# Altium schematic sheet rail_safety.SchDoc
size A
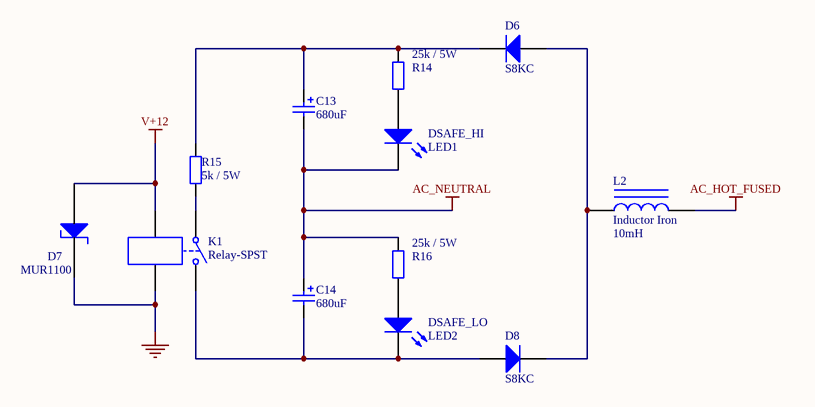
[diagram p0: rail_safety.SchDoc]

## Parts
C13  value 680uF  [Cap_450v_680uF]  (hidden comment: Cap Pol3)
C14  value 680uF  [Cap_450v_680uF]  (hidden comment: Cap Pol3)
D6  S8KC
D7  MUR1100  [DIODE-0.4]
D8  S8KC  [DIO18.84-9.6x5.6]
DSAFE_HI  LED1  [CAPC1608N]
DSAFE_LO  LED2  [CAPC1608N]
K1  Relay-SPST  [SRD-05VDC-SL-A]
L2  Inductor Iron  value 10mH  [BigInductor]
R14  25k / 5W  [AXIAL-1.0]
R15  5k / 5W  [AXIAL-1.0]
R16  25k / 5W  [AXIAL-1.0]

## Nets
AC_HOT_FUSED: L2.2
AC_NEUTRAL: C13.2 C14.1 DSAFE_HI.2(K) R16.2
GND: D7.2 K1.4
V+12: D7.1 K1.3
NetC13_1: C13.1 D6.2(K) R14.2 R15.1
NetC14_2: C14.2 D8.1(A) DSAFE_LO.2(K) K1.2
NetD6_1: D6.1(A) D8.2(K) L2.1
NetDSAFE_HI_1: DSAFE_HI.1(A) R14.1
NetDSAFE_LO_1: DSAFE_LO.1(A) R16.1
NetK1_1: K1.1 R15.2

## Library data of the parts
C13 C14 = Cap Pol3: Polarized Capacitor (Surface Mount); Published: 8-Jun-2000; LatestRevisionDate: 29-May-2009; LatestRevisionNote: IPC-7351 Footprint Added.; PackageReference: C0805; Publisher: Altium Limited; PackageDescription: Chip Capacitor
D6 D8 = Diode 1N5408: 3 Amp Medium Power Silicon Rectifier Diode; Published: 8-Jun-2000; LatestRevisionDate: 17-Jul-2002; LatestRevisionNote: Re-released for DXP Platform.; DatasheetVersion: Aug-1984; PackageReference: DO-201AD; Publisher: Altium Limited; ComponentLink1Description: Manufacturer Link; ComponentLink1URL: http://www.irf.com/
DSAFE_HI DSAFE_LO = LED3: Typical BLUE SiC LED; Published: 8-Jun-2000; LatestRevisionDate: 17-Dec-2003; LatestRevisionNote: PCB Footprint replaced.; DatasheetVersion: 16-Apr-2002; PackageVersion: 16-Apr-2002; PackageReference: 3.5X2.8X1.9; Publisher: Altium Limited
K1 = Relay-SPST: Single-Pole Single-Throw Relay; Published: 24-Mar-1999; LatestRevisionDate: 17-Jul-2002; LatestRevisionNote: Re-released for DXP Platform.; PackageReference: MODULE4; Publisher: Altium Limited
L2 = Inductor Iron: Magnetic-Core Inductor; Published: 24-Mar-1999; LatestRevisionDate: 17-Jul-2002; LatestRevisionNote: Re-released for DXP Platform.; PackageReference: AXIAL-0.9; Publisher: Altium Limited
R14-R16 = Res2: Resistor; Published: 8-Jun-2000; LatestRevisionDate: 17-Jul-2002; LatestRevisionNote: Re-released for DXP Platform.; PackageReference: AXIAL-0.4; Publisher: Altium Limited
  R14 R16: Value: 25k / 5W
  R15: Value: 5k / 5W